# Altium schematic sheet JETSON.SchDoc
size D; SheetNumber: 2; SheetTotal: 9
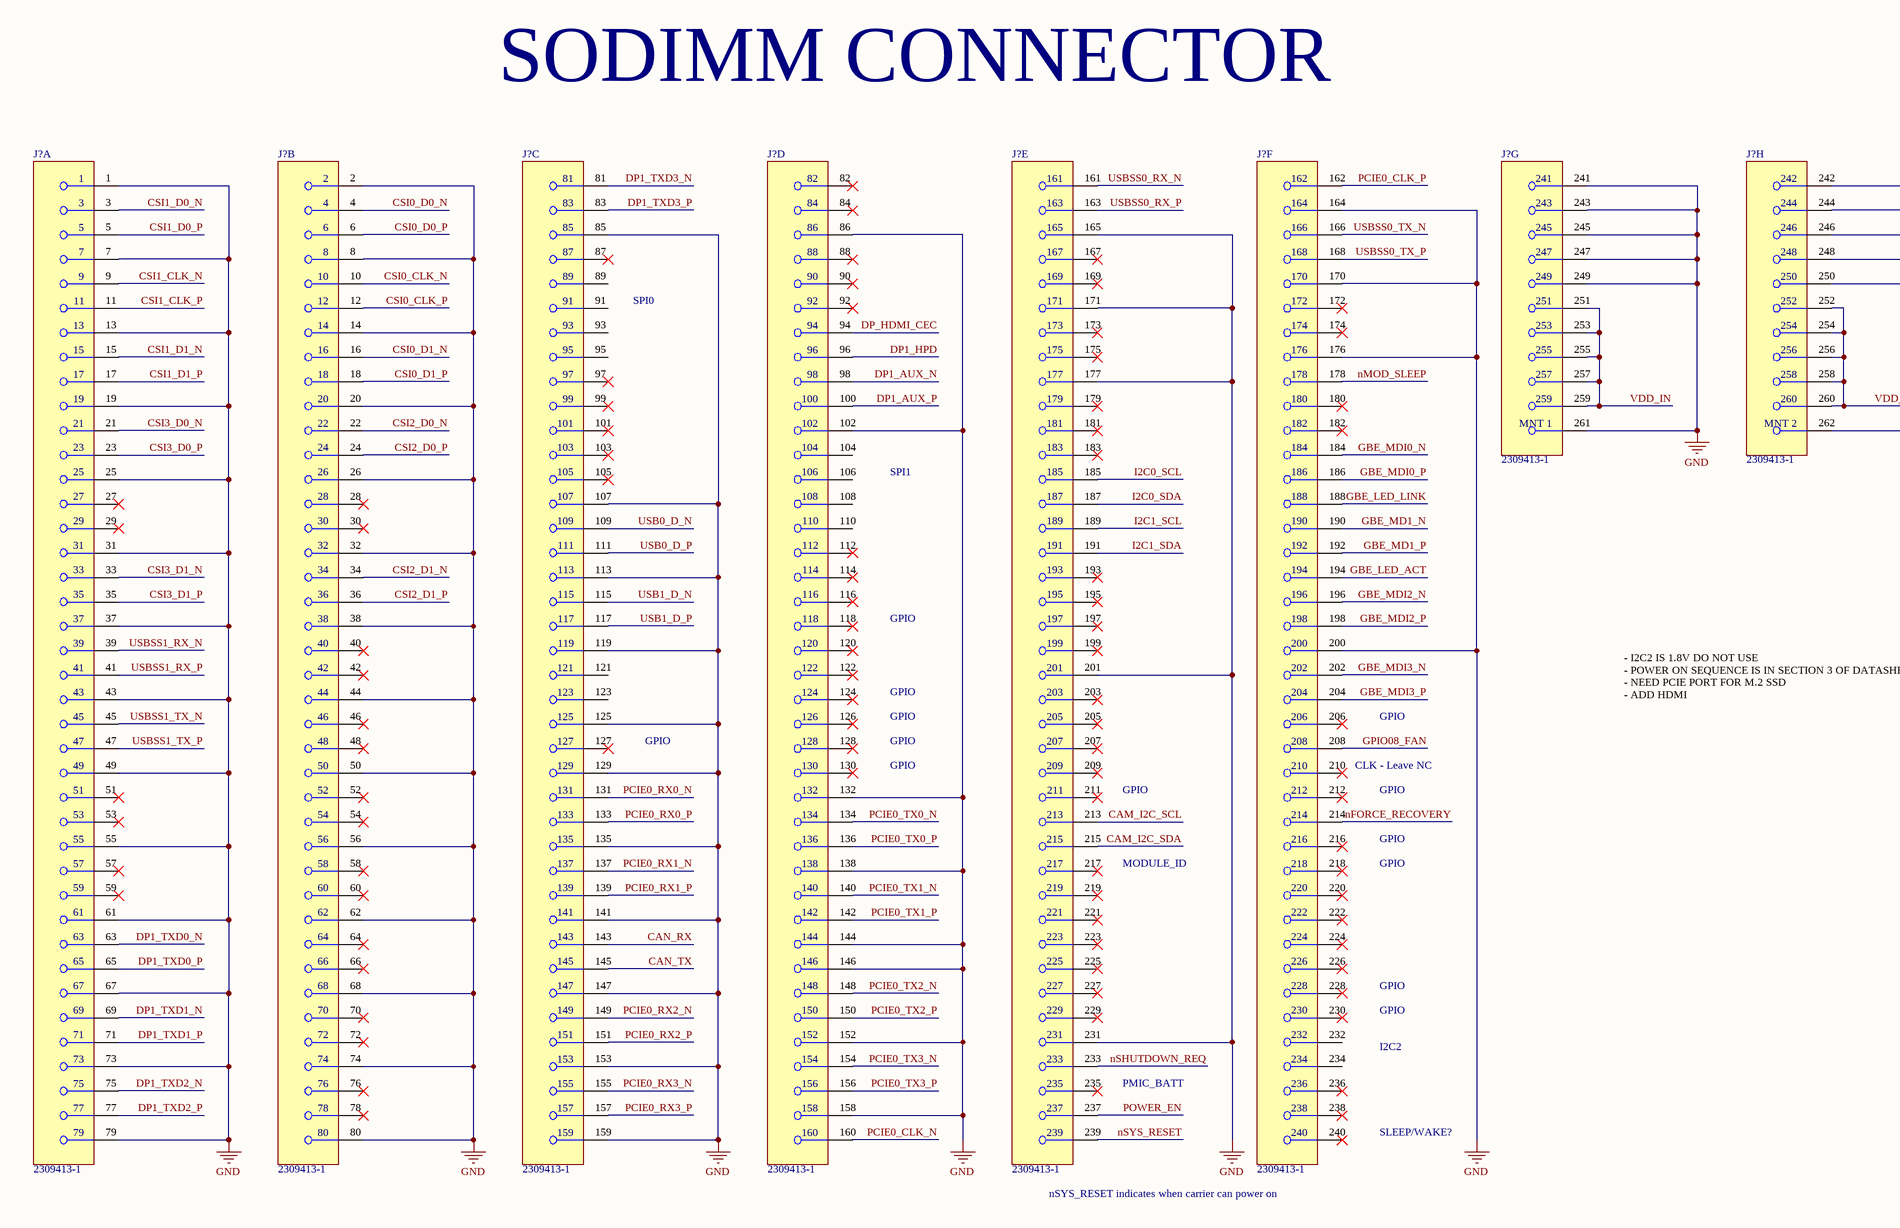
[diagram p0: JETSON.SchDoc, top left]
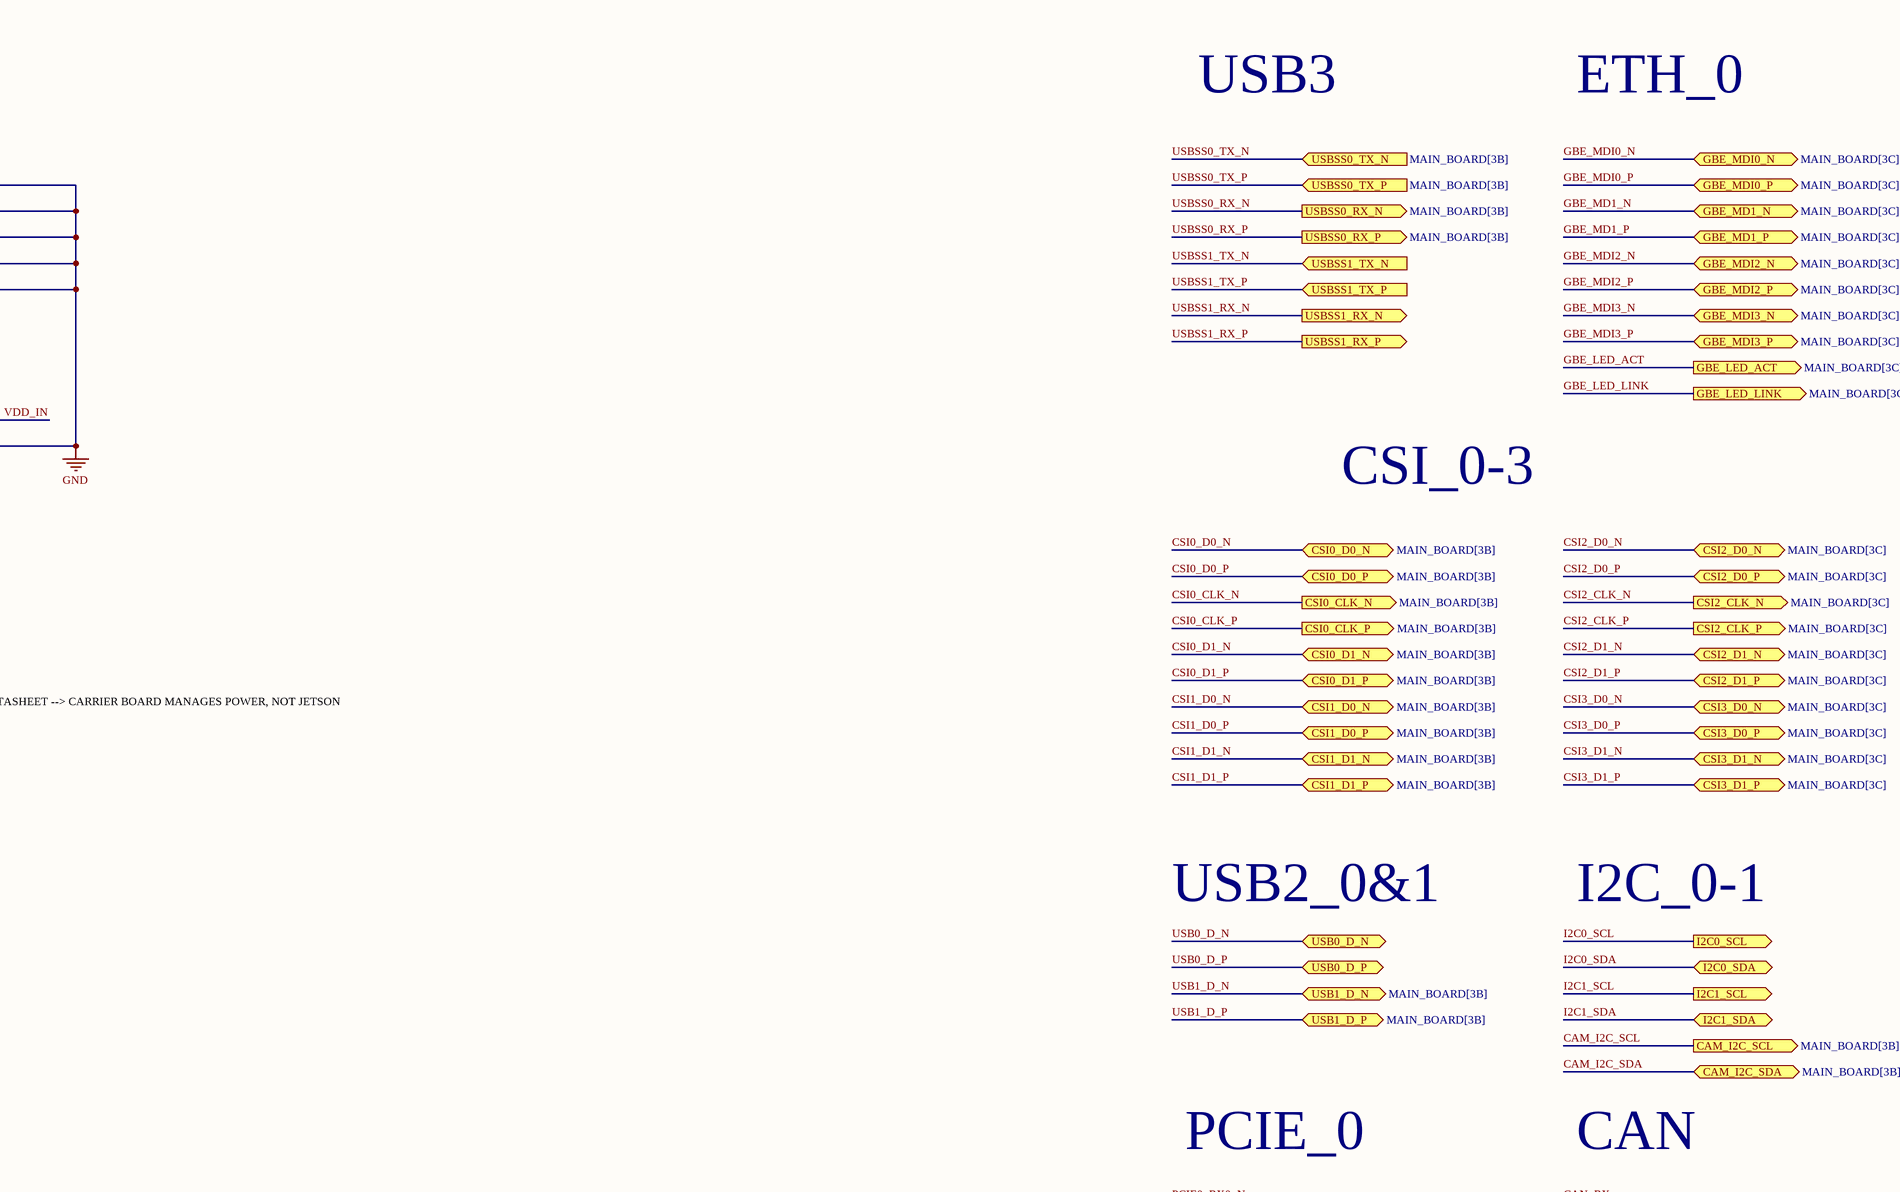
[diagram p1: JETSON.SchDoc, top right]
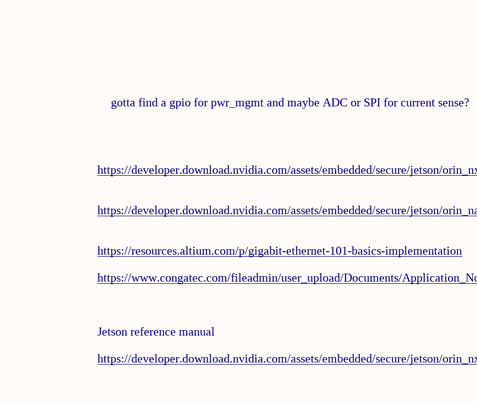
[diagram p2: JETSON.SchDoc, bottom left]
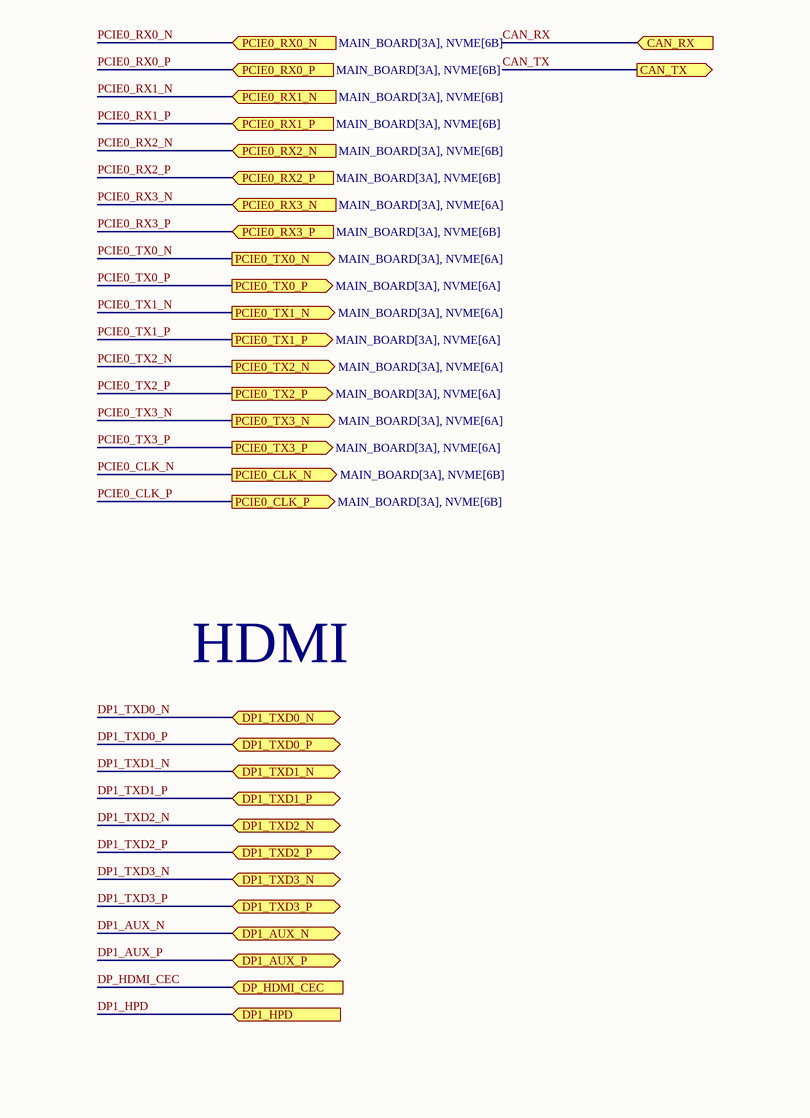
[diagram p3: JETSON.SchDoc, bottom right]

## Parts
(Parts that share a designator on the sheet are numbered #1, #2 ... from top to bottom, then left to right.)
J?#1  2309413-1  [FP-2309413-1-MFG]  (part A of 8)
J?#2  2309413-1  [FP-2309413-1-MFG]  (part B of 8)
J?#3  2309413-1  [FP-2309413-1-MFG]  (part C of 8)
J?#4  2309413-1  [FP-2309413-1-MFG]  (part D of 8)
J?#5  2309413-1  [FP-2309413-1-MFG]  (part E of 8)
J?#6  2309413-1  [FP-2309413-1-MFG]  (part F of 8)
J?#7  2309413-1  [FP-2309413-1-MFG]  (part G of 8)
J?#8  2309413-1  [FP-2309413-1-MFG]  (part H of 8)

## Ports
CAM_I2C_SCL (out, see MAIN_BOARD[3B]), CAM_I2C_SDA (bidir, see MAIN_BOARD[3B]), CAN_RX (in), CAN_TX (out), CSI0_CLK_N (out, see MAIN_BOARD[3B]), CSI0_CLK_P (out, see MAIN_BOARD[3B]), CSI0_D0_N (bidir, see MAIN_BOARD[3B]), CSI0_D0_P (bidir, see MAIN_BOARD[3B]), CSI0_D1_N (bidir, see MAIN_BOARD[3B]), CSI0_D1_P (bidir, see MAIN_BOARD[3B]), CSI1_D0_N (bidir, see MAIN_BOARD[3B]), CSI1_D0_P (bidir, see MAIN_BOARD[3B]), CSI1_D1_N (bidir, see MAIN_BOARD[3B]), CSI1_D1_P (bidir, see MAIN_BOARD[3B]), CSI2_CLK_N (out, see MAIN_BOARD[3C]), CSI2_CLK_P (out, see MAIN_BOARD[3C]), CSI2_D0_N (bidir, see MAIN_BOARD[3C]), CSI2_D0_P (bidir, see MAIN_BOARD[3C]), CSI2_D1_N (bidir, see MAIN_BOARD[3C]), CSI2_D1_P (bidir, see MAIN_BOARD[3C]), CSI3_D0_N (bidir, see MAIN_BOARD[3C]), CSI3_D0_P (bidir, see MAIN_BOARD[3C]), CSI3_D1_N (bidir, see MAIN_BOARD[3C]), CSI3_D1_P (bidir, see MAIN_BOARD[3C]), DP1_AUX_N (bidir), DP1_AUX_P (bidir), DP1_HPD (in), DP1_TXD0_N (bidir), DP1_TXD0_P (bidir), DP1_TXD1_N (bidir), DP1_TXD1_P (bidir), DP1_TXD2_N (bidir), DP1_TXD2_P (bidir), DP1_TXD3_N (bidir), DP1_TXD3_P (bidir), DP_HDMI_CEC (in), GBE_LED_ACT (out, see MAIN_BOARD[3C], ETHERNET[1B]), GBE_LED_LINK (out, see MAIN_BOARD[3C], ETHERNET[1B]), GBE_MD1_N (bidir, see MAIN_BOARD[3C]), GBE_MD1_P (bidir, see MAIN_BOARD[3C]), GBE_MDI0_N (bidir, see MAIN_BOARD[3C], ETHERNET[1A]), GBE_MDI0_P (bidir, see MAIN_BOARD[3C], ETHERNET[1A]), GBE_MDI2_N (bidir, see MAIN_BOARD[3C], ETHERNET[1A]), GBE_MDI2_P (bidir, see MAIN_BOARD[3C], ETHERNET[1A]), GBE_MDI3_N (bidir, see MAIN_BOARD[3C], ETHERNET[1B]), GBE_MDI3_P (bidir, see MAIN_BOARD[3C], ETHERNET[1A]), I2C0_SCL (out), I2C0_SDA (bidir), I2C1_SCL (out), I2C1_SDA (bidir), PCIE0_CLK_N (out, see MAIN_BOARD[3A], NVME[6B]), PCIE0_CLK_P (out, see MAIN_BOARD[3A], NVME[6B]), PCIE0_RX0_N (in, see MAIN_BOARD[3A], NVME[6B]), PCIE0_RX0_P (in, see MAIN_BOARD[3A], NVME[6B]), PCIE0_RX1_N (in, see MAIN_BOARD[3A], NVME[6B]), PCIE0_RX1_P (in, see MAIN_BOARD[3A], NVME[6B]), PCIE0_RX2_N (in, see MAIN_BOARD[3A], NVME[6B]), PCIE0_RX2_P (in, see MAIN_BOARD[3A], NVME[6B]), PCIE0_RX3_N (in, see MAIN_BOARD[3A], NVME[6A]), PCIE0_RX3_P (in, see MAIN_BOARD[3A], NVME[6B]), PCIE0_TX0_N (out, see MAIN_BOARD[3A], NVME[6A]), PCIE0_TX0_P (out, see MAIN_BOARD[3A], NVME[6A]), PCIE0_TX1_N (out, see MAIN_BOARD[3A], NVME[6A]), PCIE0_TX1_P (out, see MAIN_BOARD[3A], NVME[6A]), PCIE0_TX2_N (out, see MAIN_BOARD[3A], NVME[6A]), PCIE0_TX2_P (out, see MAIN_BOARD[3A], NVME[6A]), PCIE0_TX3_N (out, see MAIN_BOARD[3A], NVME[6A]), PCIE0_TX3_P (out, see MAIN_BOARD[3A], NVME[6A]), USB0_D_N (bidir), USB0_D_P (bidir), USB1_D_N (bidir, see MAIN_BOARD[3B]), USB1_D_P (bidir, see MAIN_BOARD[3B]), USBSS0_RX_N (out, see MAIN_BOARD[3B]), USBSS0_RX_P (out, see MAIN_BOARD[3B]), USBSS0_TX_N (in, see MAIN_BOARD[3B]), USBSS0_TX_P (in, see MAIN_BOARD[3B]), USBSS1_RX_N (out), USBSS1_RX_P (out), USBSS1_TX_N (in), USBSS1_TX_P (in)

## Nets
GND: J?#1.1 J?#1.7 J?#1.13 J?#1.19 J?#1.25 J?#1.31 J?#1.37 J?#1.43 J?#1.49 J?#1.55 J?#1.61 J?#1.67 J?#1.73 J?#1.79 J?#2.2 J?#2.8 J?#2.14 J?#2.20 J?#2.26 J?#2.32 J?#2.38 J?#2.44 J?#2.50 J?#2.56 J?#2.62 J?#2.68 J?#2.74 J?#2.80 J?#3.85 J?#3.107 J?#3.113 J?#3.119 J?#3.125 J?#3.129 J?#3.135 J?#3.141 J?#3.147 J?#3.153 J?#3.159 J?#4.86 J?#4.102 J?#4.132 J?#4.138 J?#4.144 J?#4.146 J?#4.152 J?#4.158 J?#5.165 J?#5.171 J?#5.177 J?#5.201 J?#5.231 J?#6.164 J?#6.170 J?#6.176 J?#6.200 J?#7.241 J?#7.243 J?#7.245 J?#7.247 J?#7.249 J?#7.261(MNT_1) J?#8.242 J?#8.244 J?#8.246 J?#8.248 J?#8.250 J?#8.262(MNT_2)
CAM_I2C_SCL: J?#5.213 ; port CAM_I2C_SCL
CAM_I2C_SDA: J?#5.215 ; port CAM_I2C_SDA
CAN_RX: J?#3.143 ; port CAN_RX
CAN_TX: J?#3.145 ; port CAN_TX
CSI0_CLK_N: J?#2.10 ; port CSI0_CLK_N
CSI0_CLK_P: J?#2.12 ; port CSI0_CLK_P
CSI0_D0_N: J?#2.4 ; port CSI0_D0_N
CSI0_D0_P: J?#2.6 ; port CSI0_D0_P
CSI0_D1_N: J?#2.16 ; port CSI0_D1_N
CSI0_D1_P: J?#2.18 ; port CSI0_D1_P
CSI1_CLK_N: J?#1.9
CSI1_CLK_P: J?#1.11
CSI1_D0_N: J?#1.3 ; port CSI1_D0_N
CSI1_D0_P: J?#1.5 ; port CSI1_D0_P
CSI1_D1_N: J?#1.15 ; port CSI1_D1_N
CSI1_D1_P: J?#1.17 ; port CSI1_D1_P
CSI2_CLK_N: port CSI2_CLK_N
CSI2_CLK_P: port CSI2_CLK_P
CSI2_D0_N: J?#2.22 ; port CSI2_D0_N
CSI2_D0_P: J?#2.24 ; port CSI2_D0_P
CSI2_D1_N: J?#2.34 ; port CSI2_D1_N
CSI2_D1_P: J?#2.36 ; port CSI2_D1_P
CSI3_D0_N: J?#1.21 ; port CSI3_D0_N
CSI3_D0_P: J?#1.23 ; port CSI3_D0_P
CSI3_D1_N: J?#1.33 ; port CSI3_D1_N
CSI3_D1_P: J?#1.35 ; port CSI3_D1_P
DP1_AUX_N: J?#4.98 ; port DP1_AUX_N
DP1_AUX_P: J?#4.100 ; port DP1_AUX_P
DP1_HPD: J?#4.96 ; port DP1_HPD
DP1_TXD0_N: J?#1.63 ; port DP1_TXD0_N
DP1_TXD0_P: J?#1.65 ; port DP1_TXD0_P
DP1_TXD1_N: J?#1.69 ; port DP1_TXD1_N
DP1_TXD1_P: J?#1.71 ; port DP1_TXD1_P
DP1_TXD2_N: J?#1.75 ; port DP1_TXD2_N
DP1_TXD2_P: J?#1.77 ; port DP1_TXD2_P
DP1_TXD3_N: J?#3.81 ; port DP1_TXD3_N
DP1_TXD3_P: J?#3.83 ; port DP1_TXD3_P
DP_HDMI_CEC: J?#4.94 ; port DP_HDMI_CEC
GBE_LED_ACT: J?#6.194 ; port GBE_LED_ACT
GBE_LED_LINK: J?#6.188 ; port GBE_LED_LINK
GBE_MD1_N: J?#6.190 ; port GBE_MD1_N
GBE_MD1_P: J?#6.192 ; port GBE_MD1_P
GBE_MDI0_N: J?#6.184 ; port GBE_MDI0_N
GBE_MDI0_P: J?#6.186 ; port GBE_MDI0_P
GBE_MDI2_N: J?#6.196 ; port GBE_MDI2_N
GBE_MDI2_P: J?#6.198 ; port GBE_MDI2_P
GBE_MDI3_N: J?#6.202 ; port GBE_MDI3_N
GBE_MDI3_P: J?#6.204 ; port GBE_MDI3_P
GPIO08_FAN: J?#6.208
I2C0_SCL: J?#5.185 ; port I2C0_SCL
I2C0_SDA: J?#5.187 ; port I2C0_SDA
I2C1_SCL: J?#5.189 ; port I2C1_SCL
I2C1_SDA: J?#5.191 ; port I2C1_SDA
nFORCE_RECOVERY: J?#6.214
nMOD_SLEEP: J?#6.178
nSHUTDOWN_REQ: J?#5.233
nSYS_RESET: J?#5.239
PCIE0_CLK_N: J?#4.160 ; port PCIE0_CLK_N
PCIE0_CLK_P: J?#6.162 ; port PCIE0_CLK_P
PCIE0_RX0_N: J?#3.131 ; port PCIE0_RX0_N
PCIE0_RX0_P: J?#3.133 ; port PCIE0_RX0_P
PCIE0_RX1_N: J?#3.137 ; port PCIE0_RX1_N
PCIE0_RX1_P: J?#3.139 ; port PCIE0_RX1_P
PCIE0_RX2_N: J?#3.149 ; port PCIE0_RX2_N
PCIE0_RX2_P: J?#3.151 ; port PCIE0_RX2_P
PCIE0_RX3_N: J?#3.155 ; port PCIE0_RX3_N
PCIE0_RX3_P: J?#3.157 ; port PCIE0_RX3_P
PCIE0_TX0_N: J?#4.134 ; port PCIE0_TX0_N
PCIE0_TX0_P: J?#4.136 ; port PCIE0_TX0_P
PCIE0_TX1_N: J?#4.140 ; port PCIE0_TX1_N
PCIE0_TX1_P: J?#4.142 ; port PCIE0_TX1_P
PCIE0_TX2_N: J?#4.148 ; port PCIE0_TX2_N
PCIE0_TX2_P: J?#4.150 ; port PCIE0_TX2_P
PCIE0_TX3_N: J?#4.154 ; port PCIE0_TX3_N
PCIE0_TX3_P: J?#4.156 ; port PCIE0_TX3_P
POWER_EN: J?#5.237
USB0_D_N: J?#3.109 ; port USB0_D_N
USB0_D_P: J?#3.111 ; port USB0_D_P
USB1_D_N: J?#3.115 ; port USB1_D_N
USB1_D_P: J?#3.117 ; port USB1_D_P
USBSS0_RX_N: J?#5.161 ; port USBSS0_RX_N
USBSS0_RX_P: J?#5.163 ; port USBSS0_RX_P
USBSS0_TX_N: J?#6.166 ; port USBSS0_TX_N
USBSS0_TX_P: J?#6.168 ; port USBSS0_TX_P
USBSS1_RX_N: J?#1.39 ; port USBSS1_RX_N
USBSS1_RX_P: J?#1.41 ; port USBSS1_RX_P
USBSS1_TX_N: J?#1.45 ; port USBSS1_TX_N
USBSS1_TX_P: J?#1.47 ; port USBSS1_TX_P
VDD_IN: J?#7.251 J?#7.253 J?#7.255 J?#7.257 J?#7.259 J?#8.252 J?#8.254 J?#8.256 J?#8.258 J?#8.260

Not connected (* = marked no-connect by the designer): J?#1 27* 29* 51* 53* 57* 59*; J?#2 28* 30* 40* 42* 46* 48* 52* 54* 58* 60* 64* 66* 70* 72* 76* 78*; J?#3 87* 89 91 93 95 97* 99* 101* 103* 105* 121 123 127*; J?#4 82* 84* 88* 90* 92* 104 106 108 110 112* 114* 116* 118* 120* 122* 124* 126* 128* 130*; J?#5 167* 169* 173* 175* 179* 181* 183* 193* 195* 197* 199* 203* 205* 207* 209* 211* 217* 219* 221* 223* 225* 227* 229* 235*; J?#6 172* 174* 180* 182* 206* 210* 212* 216* 218* 220* 222* 224* 226* 228* 230* 232 234 236* 238* 240*

## Notes on the sheet
- SODIMM CONNECTOR
- USB3
- ETH_0
- SPI0
- SPI1
- CSI_0-3
- GPIO
- (near J?#6) CLK - Leave NC
- MODULE_ID
- USB2_0&1
- I2C_0-1
- - I2C2 IS 1.8V DO NOT USE
  - POWER ON SEQUENCE IS IN SECTION 3 OF DATASHEET --> CARRIER BOARD MANAGES POWER, NOT JETSON
  - NEED PCIE PORT FOR M.2 SSD
  - ADD HDMI
- PMIC_BATT
- I2C2
- PCIE_0
- CAN
- SLEEP/WAKE?
- nSYS_RESET indicates when carrier can power on
- HDMI
- gotta find a gpio for pwr_mgmt and maybe ADC or SPI for current sense?
- https://developer.download.nvidia.com/assets/embedded/secure/jetson/orin_nx/docs/Jetson-Orin-NX-Series-Modules-Data-Sheet_DS-10712-001_v1.1.pdf?qhjqqJOfVnHCM-1XF3yIQpd2xfOOHwmcgVwMEoYJ7MxLV6htvBcCQBAWi_BDO8yBEWslRcUaReucjDkH91McAghWwJmYjhTJoVoEUvLFgX583-qKr_REPRGUalLshQ-DeOK5XvySH5OmW4RDnQayRqIhzIBBSUWPjFaWLdJjM1JhWiyI3hM5VtWcQCIuw7hGP4sJ7ZLCMgQXeMz6eFhUxr5xiOQPPyQ1&t=eyJscyI6ImdzZW8iLCJsc2QiOiJodHRwczovL3d3dy5nb29nbGUuY29tLyJ9
- https://developer.download.nvidia.com/assets/embedded/secure/jetson/orin_nano/docs/Jetson-Orin-Nano-Series-Modules-Data-Sheet_DS-11105-001_v1.2.pdf?jdQi_j839Sjggjj5QTF3_oOgnPN2J2ewz7Km2q-aLyRAS0YMswcsS8demvG6kdssXTo3By--j94fp-O5W54ShkpP0OL6Z16cXsATsCs5kVxLQzyDWp4PJJSuB9S5pyMOEFmtw_tlPL_Gy2oPuhK_UbNdkrgh1dCA55zEuK928asFQhAHapZ0s__KiE7erU3EBWJIZ94vBC5BwytStbskK9hDtogPdFhuGCQNTg==&t=eyJscyI6ImdzZW8iLCJsc2QiOiJodHRwczovL3d3dy5nb29nbGUuY29tLyJ9
- https://resources.altium.com/p/gigabit-ethernet-101-basics-implementation
- https://www.congatec.com/fileadmin/user_upload/Documents/Application_Notes/AN43_M.2_Pinout_Descriptions_and_Reference_Designs.pdf
- https://developer.download.nvidia.com/assets/embedded/secure/jetson/orin_nx/docs/DG-10931-001_v1.2.pdf?a9ej-2Bw8ItDc1cnJp_Orjmj0ruhafQwJG7pHYeyXv2gwzFspQ0ZbPaHE0IwtPv6h2NAYJaZXDoFolUZ5Iw8vU13fA-kLmHK94KlPsyvaeFIbWePzp1X10HDT7HvJCgNl1WkV_8WJp9-smZyxlSW_wKeuMdy5xgzu_0wxoi4gg==&t=eyJscyI6ImdzZW8iLCJsc2QiOiJodHRwczovL3d3dy5nb29nbGUuY29tLyJ9
- Jetson reference manual

## Library data of the parts
J?#1-J?#8 = CMP-03356-000001-1: DDR4 SODIMM 260P 9.2H STD; Manufacturer: TE Connectivity; Voltage Rating: 25V; Current Rating: 0.5A; Is Female: yes; Pitch: 0.5mm; Memory Type: SDRAM,DDR; Conn Orientation: Horizontal; Number Of Contacts: 260; Temperature: -55°C to +85°C; Octopart: https://octopart.com/2309413-1-te+connectivity-84799194; Device Class L3: unset; Contact Material: Gold,Nickel; ComponentLink2URL: https://www.te.com/commerce/DocumentDelivery/DDEController?Action=showdoc&DocId=Specification+Or+Standard%7F108-115122%7FA1%7Fpdf%7FEnglish%7FENG_SS_108-115122_A1.pdf%7F2309413-1; Manufacturer Part Number: 2309413-1; ComponentLink2Description: Datasheet; Digikey Description: DDR4 SODIMM 260P 9.2H STD; Height: 18.8mm; Footprint Url: https://www.te.com/commerce/DocumentDelivery/DDEController?Action=showdoc&DocId=Customer+Drawing%7F2309413%7F4%7Fpdf%7FEnglish%7FENG_CD_2309413_4.pdf%7F2309413-1; Temperature Range Low: -55°C; Device Class L2: Memory Connectors; Temperature Range High: +85°C; RoHS: TRUE; Automotive: No; Device Class L1: Connectors; Mouser Description: Conn DDR4 DIMM Socket SKT 260 POS 0.5mm Solder RA SMD T/R; Category: Conn; Package: 0; Lead Free: Yes